# EAGLE design board (EAGLE 6.6.0)
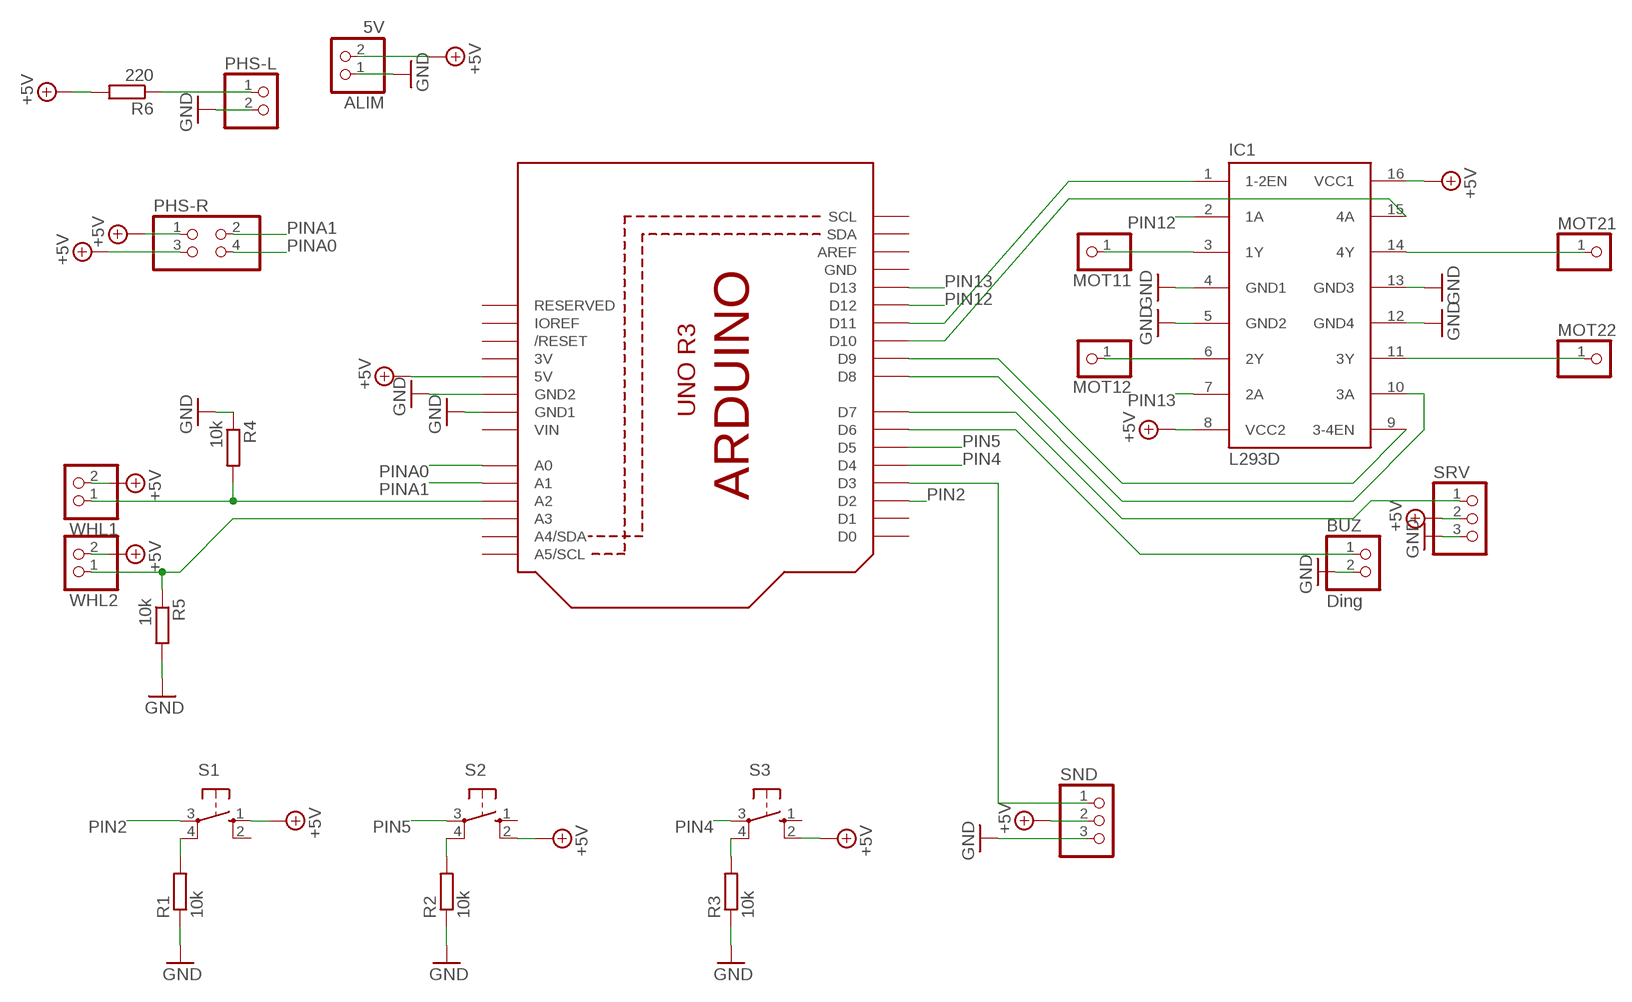
[diagram p0: schematic, sheet 1]

## Parts
ALIM  5V  PINHD-1X2  [1X02]
BUZ  Ding  PINHD-1X2  [1X02]
IC1  L293D  [DIL16]
MOT11  PINHD-1X1  [1X01]
MOT12  PINHD-1X1  [1X01]
MOT21  PINHD-1X1  [1X01]
MOT22  PINHD-1X1  [1X01]
PHS-L  PINHD-1X2  [1X02]
PHS-R  PINHD-2X2  [2X02]
R1  10k  R-EU_R1206  [R1206]
R2  10k  R-EU_R1206  [R1206]
R3  10k  R-EU_R1206  [R1206]
R4  10k  R-EU_R1206  [R1206]
R5  10k  R-EU_R1206  [R1206]
R6  220  R-EU_R1206  [R1206]
S1  10-XX  [B3F-10XX]
S2  10-XX  [B3F-10XX]
S3  10-XX  [B3F-10XX]
SND  PINHD-1X3  [1X03]
SRV  PINHD-1X3/90  [1X03/90]
U1  ARDUINOR3-BPLACE  [ARDUINOR3-BPLACE]
WHL1  PINHD-1X2  [1X02]
WHL2  PINHD-1X2  [1X02]

## Nets
+5V: ALIM.2 IC1.8(VCC2) IC1.16(VCC1) PHS-R.1 PHS-R.3 R6.2 S1.1(S) S2.2(S1) S3.2(S1) SND.2 SRV.2 U1.5V WHL1.2 WHL2.2
GND: ALIM.1 BUZ.2 IC1.4(GND1) IC1.5(GND2) IC1.12(GND4) IC1.13(GND3) PHS-L.2 R1.1 R2.1 R3.1 R4.1 R5.2 SND.3 SRV.3 U1.GND1 U1.GND2
N$1: IC1.3(1Y) MOT11.1
N$2: IC1.6(2Y) MOT12.1
N$3: IC1.14(4Y) MOT21.1
N$4: IC1.11(3Y) MOT22.1
N$7: IC1.15(4A) U1.D10
N$8: IC1.9(3-4EN) U1.D9
N$9: IC1.10(3A) U1.D8
N$10: IC1.1(1-2EN) U1.D11
N$11: R4.2 U1.A2 WHL1.1
N$12: PHS-L.1 R6.1
N$13: R5.1 U1.A3 WHL2.1
N$14: SRV.1 U1.D7
N$16: BUZ.1 U1.D6
N$18: R2.2 S2.4(P1)
N$20: R3.2 S3.4(P1)
N$21: R1.2 S1.4(P1)
N$22: SND.1 U1.D3
PIN2: S1.3(P) U1.D2
PIN4: S3.3(P) U1.D4
PIN5: S2.3(P) U1.D5
PIN12: IC1.2(1A) U1.D12
PIN13: IC1.7(2A) U1.D13
PINA0: PHS-R.4 U1.A0
PINA1: PHS-R.2 U1.A1
Unconnected: S1.2(S1) S2.1(S) S3.1(S) U1.A4(A4/SDA) U1.A5(A5/SCL) U1.AREF U1.D0 U1.D1 U1.IOREF U1.RESERVED U1.RESET(/RESET) U1.SCL U1.SDA

## Power pins joined to a net without a drawn wire
3V: U1.3V
GND: U1.GND
VIN: U1.VIN

## Library data of the parts
ALIM BUZ PHS-L WHL1 WHL2 = pinhead:PINHD-1X2: PIN HEADER
IC1 = st-microelectronics:L293D: PUSH-PULL 4 CHANNEL DRIVER; MPN: L293D; OC_FARNELL: 9589619; OC_NEWARK: 56P8249
MOT11 MOT12 MOT21 MOT22 = pinhead:PINHD-1X1: PIN HEADER
PHS-R = pinhead:PINHD-2X2: PIN HEADER
R1-R6 = resistor:R-EU_: RESISTOR, European symbol
S1-S3 = switch-omron:10-XX: OMRON SWITCH; MPN: B3F-1000; OC_FARNELL: 176432; OC_NEWARK: 36M3542
SND SRV = pinhead:PINHD-1X3: PIN HEADER
U1 = adafruit:ARDUINOR3: This is a new object for the new Arduino R3 - with extra pins that you may want to use (such as IOref, and duplicated A4/A5

## Net classes
0 default: width 0.406 mm, clearance 0.205 mm

## Board
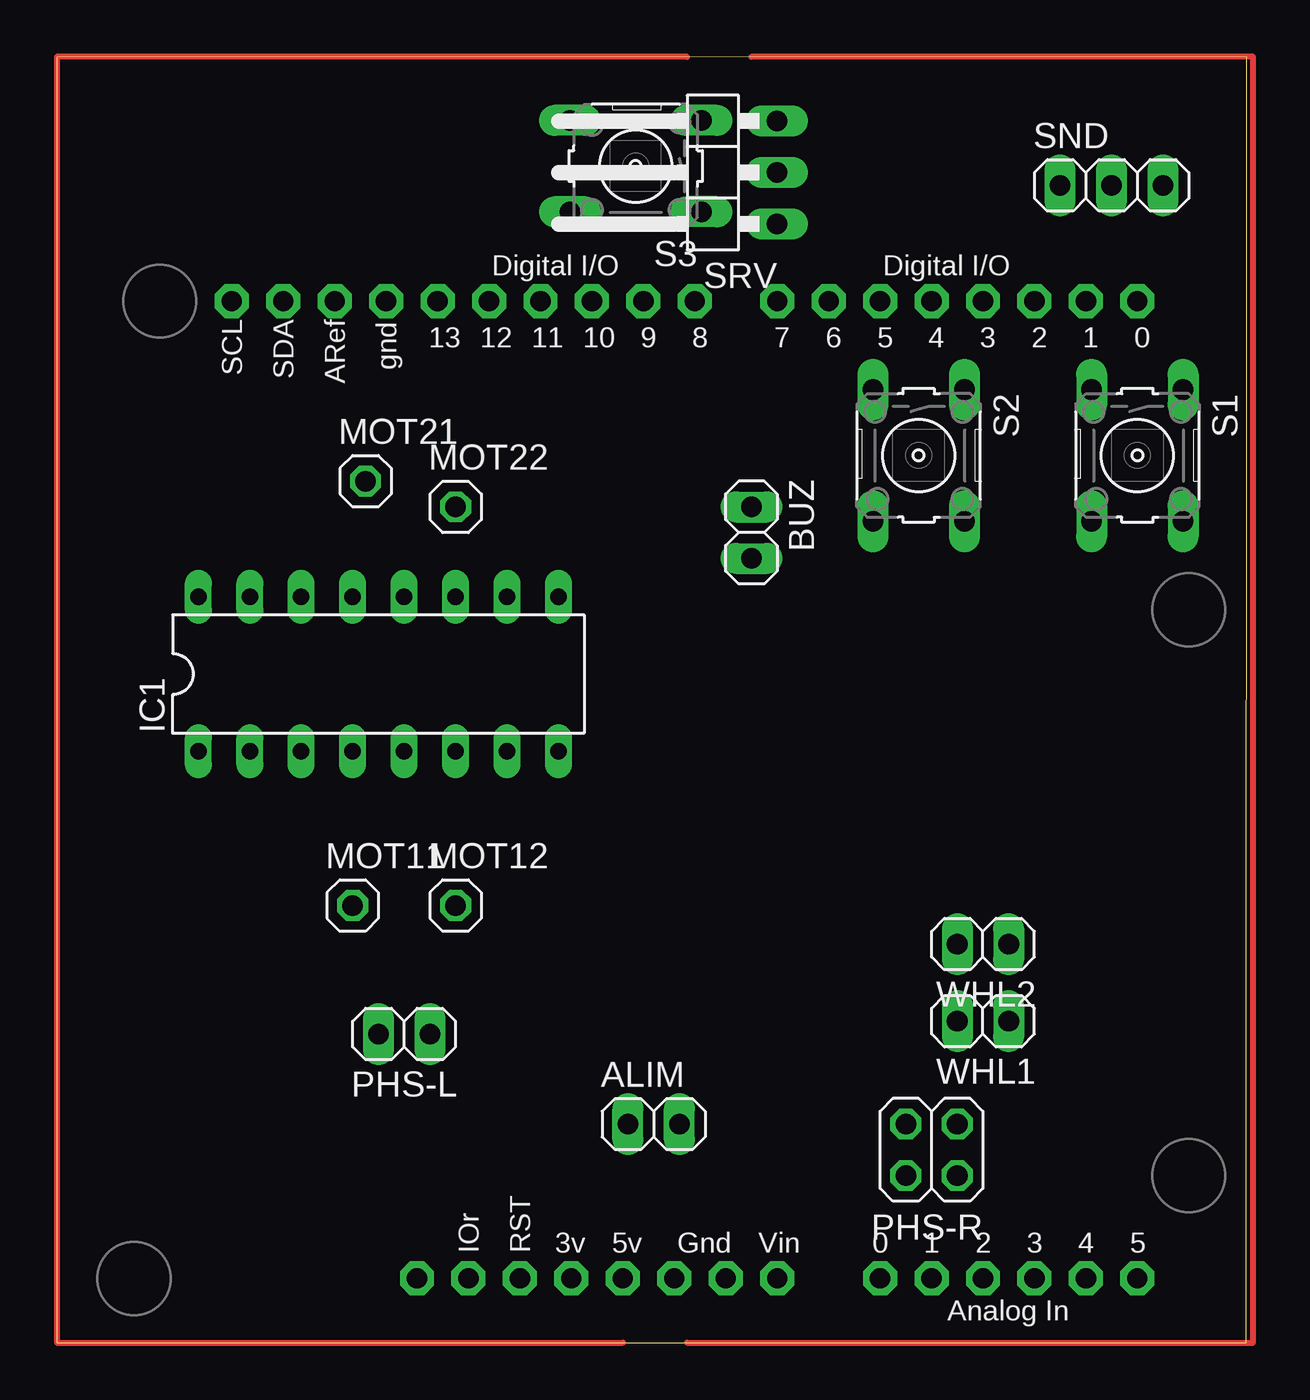
[diagram p1: board, top side]
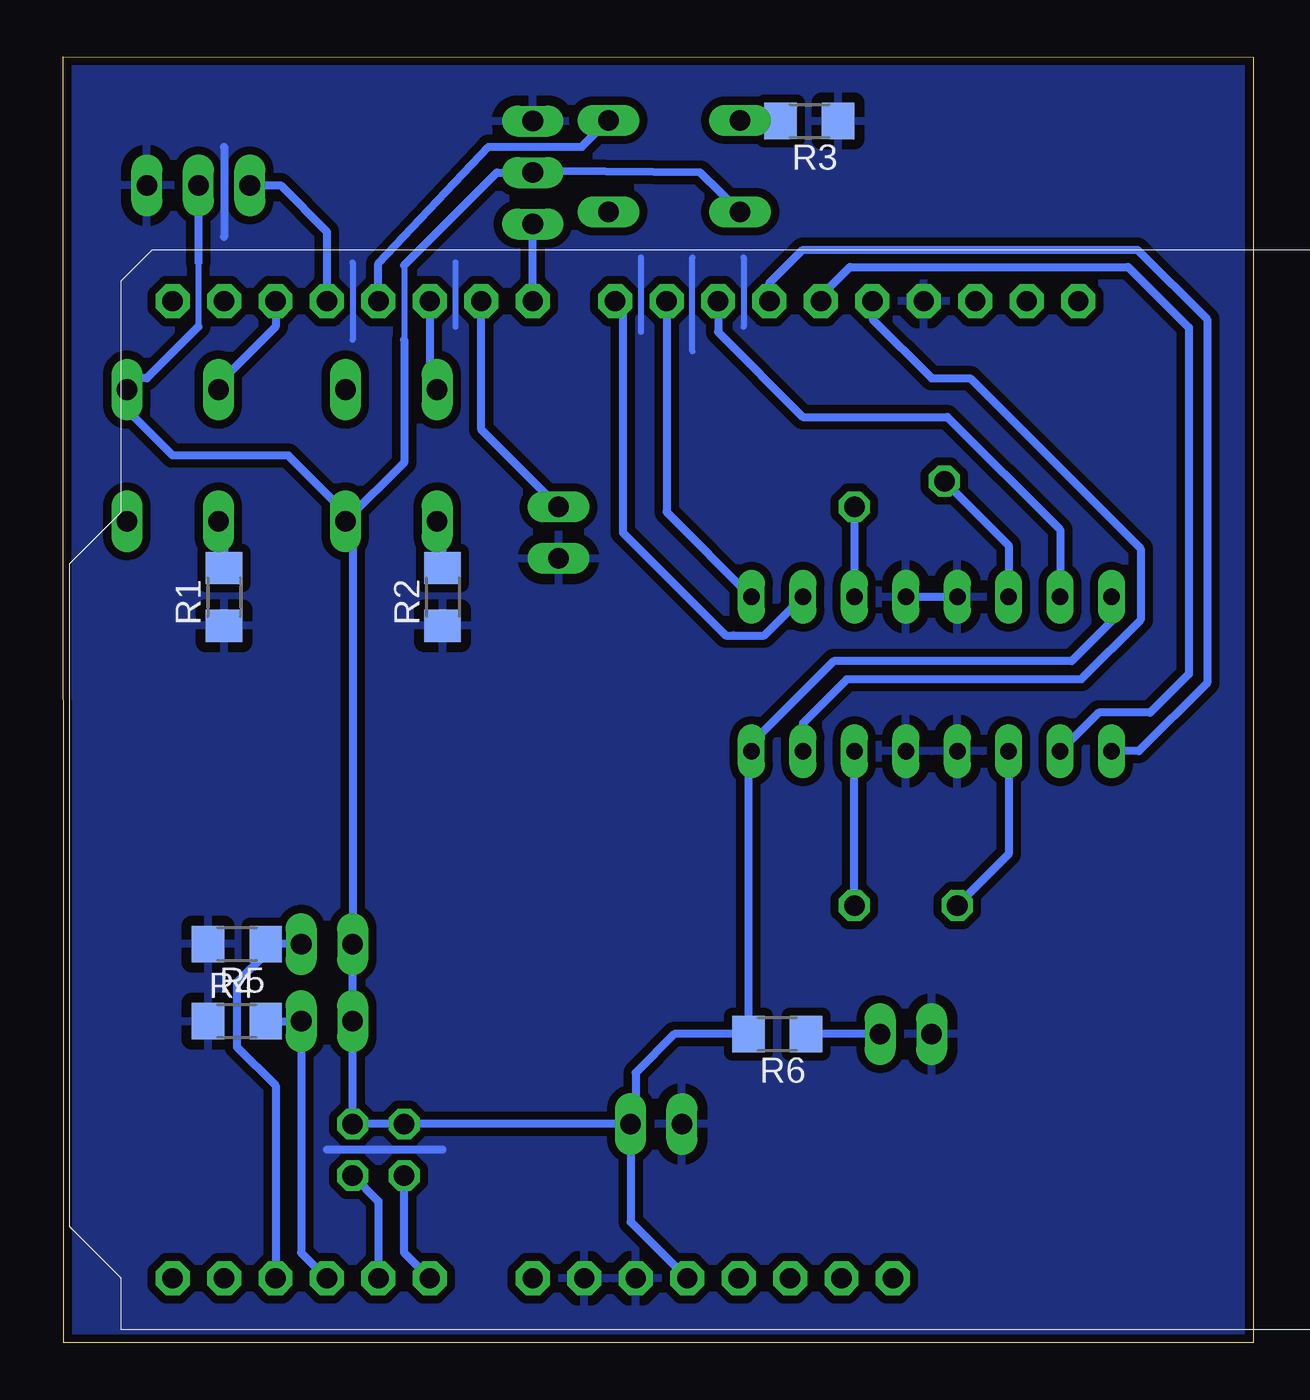
[diagram p2: board, bottom side, seen from below]

Size 58.74 x 63.5 mm. Coordinates in mm from the lower left corner, seen from the top.
Outline: 0,0 58.73,0 58.74,63.5 0,63.49 0,0
Copper layers (1*16): Top 0.035mm / dielectric 1.5mm / Bottom 0.035mm
Design rules "default *": minimum track width 10mil, minimum drill 24mil, track to track 8mil, track to pad 8mil, pad to pad 8mil, via to via 8mil, smd to smd 8mil, copper to edge 10mil, drill to drill 8mil, minimum pad ring 10mil, minimum via ring 8mil, stop-mask expansion 4mil, vias tented up to drill 0mil, thermal gap 20mil

### Footprints (pad centres in the part's own frame; a part is rotated, then mirrored left to right if it is on the bottom)
1X02 = drill 1.016 long: 1 -1.27,0; 2 1.27,0
DIL16 = drill 0.813 long: 1 -8.89,-3.81; 2 -6.35,-3.81; 3 -3.81,-3.81; 4 -1.27,-3.81; 5 1.27,-3.81; 6 3.81,-3.81; 7 6.35,-3.81; 8 8.89,-3.81; 9 8.89,3.81; 10 6.35,3.81; 11 3.81,3.81; 12 1.27,3.81; 13 -1.27,3.81; 14 -3.81,3.81; 15 -6.35,3.81; 16 -8.89,3.81
1X01 = drill 1.016 octagon: 1 0,0
2X02 = drill 1.016 octagon: 1 -1.27,-1.27; 2 -1.27,1.27; 3 1.27,-1.27; 4 1.27,1.27
R1206 = smd 1.6 x 1.803: 1 -1.422,0; 2 1.422,0
B3F-10XX = drill 1.016 long: 1 -3.251,2.261; 2 3.251,2.261; 3 -3.251,-2.261; 4 3.251,-2.261
1X03 = drill 1.016 long: 1 -2.54,0; 2 0,0; 3 2.54,0
1X03/90 = drill 1.016 long: 1 -2.54,-3.81; 2 0,-3.81; 3 2.54,-3.81
ARDUINOR3-BPLACE = drill 1 pad 1.676 octagon: 3V 35.56,2.54; 5V 38.1,2.54; A0 50.8,2.54; A1 53.34,2.54; A2 55.88,2.54; A3 58.42,2.54; A4 60.96,2.54; A5 63.5,2.54; AREF 23.876,50.8; D0 63.5,50.8; D1 60.96,50.8; D2 58.42,50.8; D3 55.88,50.8; D4 53.34,50.8; D5 50.8,50.8; D6 48.26,50.8; D7 45.72,50.8; D8 41.656,50.8; D9 39.116,50.8; D10 36.576,50.8; D11 34.036,50.8; D12 31.496,50.8; D13 28.956,50.8; GND 26.416,50.8; GND1 43.18,2.54; GND2 40.64,2.54; IOREF 30.48,2.54; RESERVED 27.94,2.54; RESET 33.02,2.54; SCL 18.796,50.8; SDA 21.336,50.8; VIN 45.72,2.54

### Placement (x,y rotation side)
ALIM  29.46,10.79 0 top
BUZ  34.29,40.01 270 top
IC1  15.88,33.02 0 top
MOT11  14.61,21.59 0 top
MOT12  19.68,21.59 0 top
MOT21  15.24,42.55 0 top
MOT22  19.68,41.27 0 top
PHS-L  17.14,15.24 180 top
PHS-R  43.18,9.53 180 top
R1  50.8,36.83 90 bottom
R2  40.01,36.83 90 bottom
R3  21.91,60.33 180 bottom
R4  50.16,15.88 0 bottom
R5  50.16,19.68 180 bottom
R6  23.5,15.24 180 bottom
S1  53.34,43.81 270 top
S2  42.55,43.81 270 top
S3  28.57,58.1 180 top
SND  52.07,57.15 0 top
SRV  31.75,57.78 90 top
U1  -10.16,0.64 0 top
WHL1  45.72,15.88 180 top
WHL2  45.72,19.68 180 top

### Tracks (layer width: path | path; a pad name or v marks a point on that pad's centre or on a via)
+5V
  Bottom 0.305: 52.07,53.34 52.07,50.55 52.07,50.16 | 41.91,53.21 41.91,49.53
  Bottom 0.406: S3.2 27.3,57.78 34.29,57.85 35.31,57.78 SRV.2 37.33,57.78 41.91,53.21 | IC1.16 6.99,35.63 8.96,33.66 20.7,33.66 24.77,29.59 IC1.8 24.92,29.06 R6.2 28.57,15.24 30.48,13.34 30.48,11.05 ALIM.2 | S2.2 45.01,41.2 47.62,43.81 53.34,43.81 55.6,46.08 S1.1 55.04,47.62 54.61,47.62 52.07,50.16 | SND.2 52.07,53.34 | ALIM.2 30.73,5.97 U1.5V | ALIM.2 PHS-R.3 PHS-R.1 WHL1.2 WHL2.2 44.45,40.21 S2.2 | 41.91,49.53 41.91,43.46 S2.2
GND
  Bottom 0.305: 27.69,48.96 27.69,53.59 | 44.45,53.34 44.45,49.53 | 25.15,53.59 25.15,50.16 | 30.23,53.59 30.23,49.91 | 39.37,50.16 39.37,53.34
  Bottom 0.406: U1.GND1 32.97,3.22 | 31.11,3.17 U1.GND2 | IC1.13 IC1.12 | 40.01,9.53 45.72,9.53 | 50.8,59.05 50.8,54.61
  pour Bottom (isolate 0.406): 0,63.5 0,0 59.05,0 59.05,63.5
N$1
  Bottom 0.406: IC1.3 12.06,24.13 MOT11.1
N$2
  Bottom 0.406: MOT12.1 IC1.6
N$3
  Bottom 0.406: MOT21.1 12.06,39.37 IC1.14
N$4
  Bottom 0.406: MOT22.1 IC1.11
N$5
  Top 0.305: 31.11,63.5 0,63.5 0,0 27.94,0
N$6
  Top 0.305: 31.11,0 59.05,0 59.05,63.5 34.29,63.5
N$7
  Bottom 0.406: U1.D10 26.42,49.91 22.23,45.72 15.1,45.72 9.53,40.15 IC1.15
N$8
  Bottom 0.406: IC1.9 28.96,41.02 U1.D9
N$9
  Bottom 0.406: IC1.10 24.13,34.92 25.65,34.92 26.04,34.92 31.11,40.01 31.11,50.8 31.5,51.18 U1.D8
N$10
  Bottom 0.406: U1.D11 23.88,52.32 22.23,53.98 5.71,53.98 2.28,50.54 2.28,32.57 5.64,29.21 IC1.1
N$11
  Bottom 0.406: U1.A2 46.99,4.45 WHL1.1 R4.2
N$12
  Bottom 0.406: PHS-L.1 R6.1
N$13
  Bottom 0.406: WHL2.1 R5.1 48.74,19.2 50.16,17.78 50.16,14.61 48.26,12.7 U1.A3
N$14
  Bottom 0.406: U1.D7 SRV.1
N$16
  Bottom 0.406: BUZ.1 38.1,45.09 U1.D6
N$18
  Bottom 0.406: R2.2 40.01,40.28 S2.4
N$20
  Bottom 0.406: R3.2 24.77,60.33 S3.4
N$21
  Bottom 0.406: R1.2 50.8,40.01 S1.4
N$22
  Bottom 0.406: SND.1 48.01,57.15 45.72,54.86 U1.D3
PIN2
  Bottom 0.406: U1.D2 48.26,50.16 51.08,47.35 S1.3
PIN4
  Bottom 0.406: U1.D4 43.18,53.3 37.74,59.05 33.13,59.05 S3.3
PIN5
  Bottom 0.406: U1.D5 40.64,47.42 S2.3
PIN12
  Bottom 0.406: U1.D12 21.34,51.69 19.91,53.12 6.17,53.12 3.17,50.13 3.17,33.02 5.08,31.11 7.62,31.11 IC1.2
PIN13
  Bottom 0.305: 20.07,32.75 20.07,32.77
  Bottom 0.406: U1.D13 18.8,50.55 15.88,47.62 13.97,47.62 5.55,39.21 5.55,35.69 8.48,32.77 20.07,32.77 | IC1.7 22.23,30.59 20.07,32.75
PINA0
  Bottom 0.406: U1.A0 41.91,4.45 PHS-R.4
PINA1
  Bottom 0.406: U1.A1 43.18,6.99 PHS-R.2